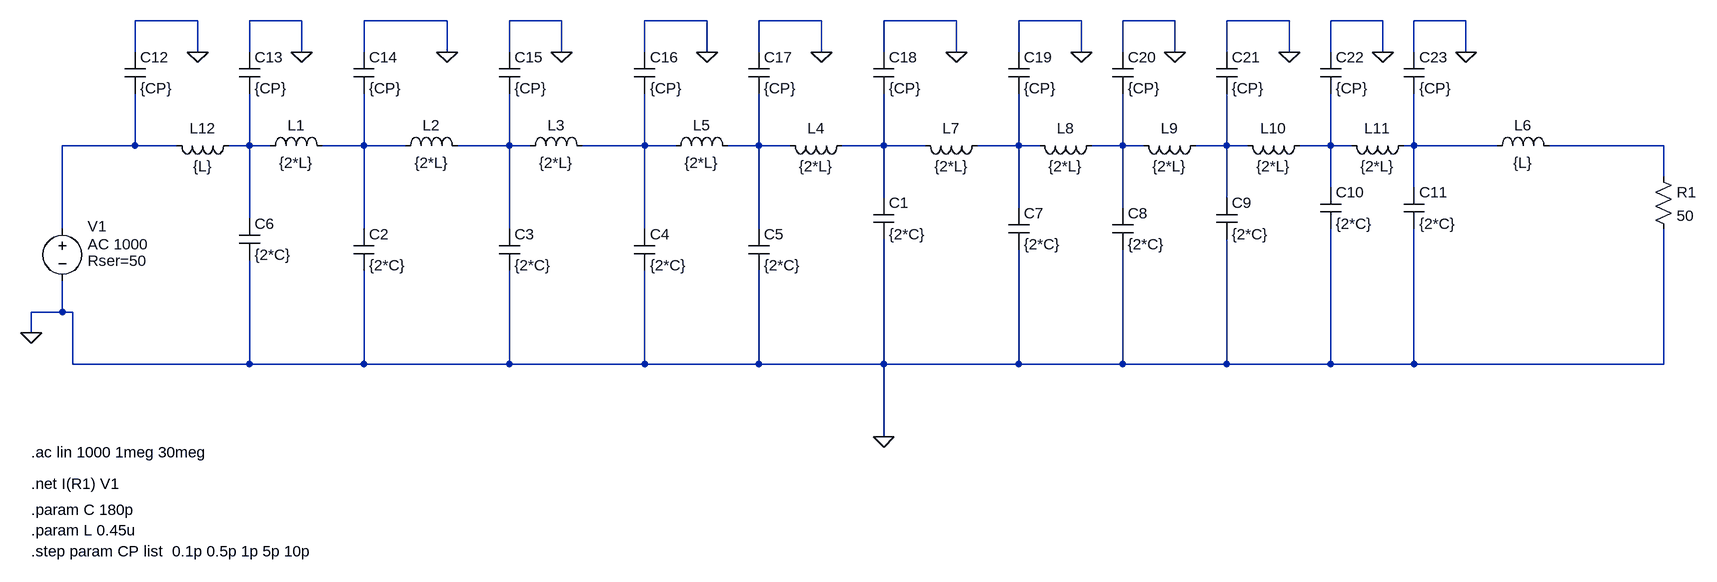
[diagram p0: schematic basicLC_fixcp.asc]
basicLC_fixcp.asc, the LTspice schematic file:
Version 4
SHEET 1 1324 680
WIRE -1408 -368 -1504 -368
WIRE -1248 -368 -1328 -368
WIRE -1024 -368 -1152 -368
WIRE -848 -368 -928 -368
WIRE -624 -368 -720 -368
WIRE -448 -368 -544 -368
WIRE -240 -368 -352 -368
WIRE -48 -368 -144 -368
WIRE 96 -368 16 -368
WIRE 272 -368 176 -368
WIRE 416 -368 336 -368
WIRE 544 -368 464 -368
WIRE -1504 -320 -1504 -368
WIRE -1408 -320 -1408 -368
WIRE -1328 -320 -1328 -368
WIRE -1248 -320 -1248 -368
WIRE -1152 -320 -1152 -368
WIRE -1024 -320 -1024 -368
WIRE -928 -320 -928 -368
WIRE -848 -320 -848 -368
WIRE -720 -320 -720 -368
WIRE -624 -320 -624 -368
WIRE -544 -320 -544 -368
WIRE -448 -320 -448 -368
WIRE -352 -320 -352 -368
WIRE -240 -320 -240 -368
WIRE -144 -320 -144 -368
WIRE -48 -320 -48 -368
WIRE 16 -320 16 -368
WIRE 96 -320 96 -368
WIRE 176 -320 176 -368
WIRE 272 -320 272 -368
WIRE 336 -320 336 -368
WIRE 416 -320 416 -368
WIRE 464 -320 464 -368
WIRE 544 -320 544 -368
WIRE -1504 -176 -1504 -256
WIRE -1504 -176 -1616 -176
WIRE -1440 -176 -1504 -176
WIRE -1328 -176 -1328 -256
WIRE -1328 -176 -1360 -176
WIRE -1296 -176 -1328 -176
WIRE -1152 -176 -1152 -256
WIRE -1152 -176 -1216 -176
WIRE -1088 -176 -1152 -176
WIRE -928 -176 -928 -256
WIRE -928 -176 -1008 -176
WIRE -896 -176 -928 -176
WIRE -720 -176 -720 -256
WIRE -720 -176 -816 -176
WIRE -672 -176 -720 -176
WIRE -544 -176 -544 -256
WIRE -544 -176 -592 -176
WIRE -496 -176 -544 -176
WIRE -352 -176 -352 -256
WIRE -352 -176 -416 -176
WIRE -288 -176 -352 -176
WIRE -144 -176 -144 -256
WIRE -144 -176 -208 -176
WIRE -112 -176 -144 -176
WIRE 16 -176 16 -256
WIRE 16 -176 -32 -176
WIRE 48 -176 16 -176
WIRE 176 -176 176 -256
WIRE 176 -176 128 -176
WIRE 208 -176 176 -176
WIRE 336 -176 336 -256
WIRE 336 -176 288 -176
WIRE 368 -176 336 -176
WIRE 464 -176 464 -256
WIRE 464 -176 448 -176
WIRE 592 -176 464 -176
WIRE 848 -176 672 -176
WIRE 848 -128 848 -176
WIRE 336 -112 336 -176
WIRE 464 -112 464 -176
WIRE -352 -96 -352 -176
WIRE 176 -96 176 -176
WIRE -144 -80 -144 -176
WIRE 16 -80 16 -176
WIRE -1328 -64 -1328 -176
WIRE -1616 -48 -1616 -176
WIRE -1152 -48 -1152 -176
WIRE -928 -48 -928 -176
WIRE -720 -48 -720 -176
WIRE -544 -48 -544 -176
WIRE -1616 80 -1616 32
WIRE -1616 80 -1664 80
WIRE -1600 80 -1616 80
WIRE -1664 112 -1664 80
WIRE -1600 160 -1600 80
WIRE -1328 160 -1328 0
WIRE -1328 160 -1600 160
WIRE -1152 160 -1152 16
WIRE -1152 160 -1328 160
WIRE -928 160 -928 16
WIRE -928 160 -1152 160
WIRE -720 160 -720 16
WIRE -720 160 -928 160
WIRE -544 160 -544 16
WIRE -544 160 -720 160
WIRE -352 160 -352 -32
WIRE -352 160 -544 160
WIRE -144 160 -144 -16
WIRE -144 160 -352 160
WIRE 16 160 16 -16
WIRE 16 160 -144 160
WIRE 176 160 176 -32
WIRE 176 160 16 160
WIRE 336 160 336 -48
WIRE 336 160 176 160
WIRE 464 160 464 -48
WIRE 464 160 336 160
WIRE 848 160 848 -48
WIRE 848 160 464 160
WIRE -352 272 -352 160
FLAG -1664 112 0
FLAG -352 272 0
FLAG -1408 -320 0
FLAG -1248 -320 0
FLAG -1024 -320 0
FLAG -848 -320 0
FLAG -624 -320 0
FLAG -448 -320 0
FLAG -240 -320 0
FLAG -48 -320 0
FLAG 96 -320 0
FLAG 272 -320 0
FLAG 416 -320 0
FLAG 544 -320 0
SYMBOL voltage -1616 -64 R0
WINDOW 0 39 12 Left 2
WINDOW 123 39 40 Left 2
WINDOW 39 39 65 Left 2
SYMATTR InstName V1
SYMATTR Value2 AC 1000
SYMATTR SpiceLine Rser=50
SYMATTR Value ""
SYMBOL ind -1312 -160 R270
WINDOW 0 32 56 VTop 2
WINDOW 3 5 56 VBottom 2
SYMATTR InstName L1
SYMATTR Value {2*L}
SYMBOL ind -1104 -160 R270
WINDOW 0 32 56 VTop 2
WINDOW 3 5 56 VBottom 2
SYMATTR InstName L2
SYMATTR Value {2*L}
SYMBOL ind -912 -160 R270
WINDOW 0 32 56 VTop 2
WINDOW 3 5 56 VBottom 2
SYMATTR InstName L3
SYMATTR Value {2*L}
SYMBOL ind -688 -160 R270
WINDOW 0 32 56 VTop 2
WINDOW 3 5 56 VBottom 2
SYMATTR InstName L5
SYMATTR Value {2*L}
SYMBOL ind 576 -160 R270
WINDOW 0 32 56 VTop 2
WINDOW 3 5 56 VBottom 2
SYMATTR InstName L6
SYMATTR Value {L}
SYMBOL res 832 -144 R0
SYMATTR InstName R1
SYMATTR Value 50
SYMBOL cap -1168 -48 R0
SYMATTR InstName C2
SYMATTR Value {2*C}
SYMBOL cap -944 -48 R0
SYMATTR InstName C3
SYMATTR Value {2*C}
SYMBOL cap -736 -48 R0
SYMATTR InstName C4
SYMATTR Value {2*C}
SYMBOL cap -560 -48 R0
SYMATTR InstName C5
SYMATTR Value {2*C}
SYMBOL cap -368 -96 R0
SYMATTR InstName C1
SYMATTR Value {2*C}
SYMBOL ind -400 -192 R90
WINDOW 0 5 56 VBottom 2
WINDOW 3 32 56 VTop 2
SYMATTR InstName L4
SYMATTR Value {2*L}
SYMBOL ind -192 -192 R90
WINDOW 0 5 56 VBottom 2
WINDOW 3 32 56 VTop 2
SYMATTR InstName L7
SYMATTR Value {2*L}
SYMBOL ind -16 -192 R90
WINDOW 0 5 56 VBottom 2
WINDOW 3 32 56 VTop 2
SYMATTR InstName L8
SYMATTR Value {2*L}
SYMBOL ind 144 -192 R90
WINDOW 0 5 56 VBottom 2
WINDOW 3 32 56 VTop 2
SYMATTR InstName L9
SYMATTR Value {2*L}
SYMBOL ind 304 -192 R90
WINDOW 0 5 56 VBottom 2
WINDOW 3 32 56 VTop 2
SYMATTR InstName L10
SYMATTR Value {2*L}
SYMBOL ind 464 -192 R90
WINDOW 0 5 56 VBottom 2
WINDOW 3 32 56 VTop 2
SYMATTR InstName L11
SYMATTR Value {2*L}
SYMBOL ind -1344 -192 R90
WINDOW 0 5 56 VBottom 2
WINDOW 3 32 56 VTop 2
SYMATTR InstName L12
SYMATTR Value {L}
SYMBOL cap -1344 -64 R0
SYMATTR InstName C6
SYMATTR Value {2*C}
SYMBOL cap -160 -80 R0
SYMATTR InstName C7
SYMATTR Value {2*C}
SYMBOL cap 0 -80 R0
SYMATTR InstName C8
SYMATTR Value {2*C}
SYMBOL cap 160 -96 R0
SYMATTR InstName C9
SYMATTR Value {2*C}
SYMBOL cap 320 -112 R0
SYMATTR InstName C10
SYMATTR Value {2*C}
SYMBOL cap 448 -112 R0
SYMATTR InstName C11
SYMATTR Value {2*C}
SYMBOL cap -1520 -320 R0
SYMATTR InstName C12
SYMATTR Value {CP}
SYMBOL cap -1344 -320 R0
SYMATTR InstName C13
SYMATTR Value {CP}
SYMBOL cap -1168 -320 R0
SYMATTR InstName C14
SYMATTR Value {CP}
SYMBOL cap -944 -320 R0
SYMATTR InstName C15
SYMATTR Value {CP}
SYMBOL cap -736 -320 R0
SYMATTR InstName C16
SYMATTR Value {CP}
SYMBOL cap -560 -320 R0
SYMATTR InstName C17
SYMATTR Value {CP}
SYMBOL cap -368 -320 R0
SYMATTR InstName C18
SYMATTR Value {CP}
SYMBOL cap -160 -320 R0
SYMATTR InstName C19
SYMATTR Value {CP}
SYMBOL cap 0 -320 R0
SYMATTR InstName C20
SYMATTR Value {CP}
SYMBOL cap 160 -320 R0
SYMATTR InstName C21
SYMATTR Value {CP}
SYMBOL cap 320 -320 R0
SYMATTR InstName C22
SYMATTR Value {CP}
SYMBOL cap 448 -320 R0
SYMATTR InstName C23
SYMATTR Value {CP}
TEXT -1664 296 Left 2 !.ac lin 1000 1meg 30meg
TEXT -1664 344 Left 2 !.net I(R1) V1
TEXT -1664 384 Left 2 !.param C 180p
TEXT -1664 416 Left 2 !.param L 0.45u
TEXT -1664 448 Left 2 !.step param CP list  0.1p 0.5p 1p 5p 10p

The netlist it stands for:
* basicLC_fixcp.asc
V1 N001 0 AC 1000 Rser=50
L1 N002 N003 {2*L}
L2 N003 N004 {2*L}
L3 N004 N005 {2*L}
L5 N005 N006 {2*L}
L6 N012 N013 {L}
R1 N013 0 50
C2 N003 0 {2*C}
C3 N004 0 {2*C}
C4 N005 0 {2*C}
C5 N006 0 {2*C}
C1 N007 0 {2*C}
L4 N007 N006 {2*L}
L7 N008 N007 {2*L}
L8 N009 N008 {2*L}
L9 N010 N009 {2*L}
L10 N011 N010 {2*L}
L11 N012 N011 {2*L}
L12 N002 N001 {L}
C6 N002 0 {2*C}
C7 N008 0 {2*C}
C8 N009 0 {2*C}
C9 N010 0 {2*C}
C10 N011 0 {2*C}
C11 N012 0 {2*C}
C12 0 N001 {CP}
C13 0 N002 {CP}
C14 0 N003 {CP}
C15 0 N004 {CP}
C16 0 N005 {CP}
C17 0 N006 {CP}
C18 0 N007 {CP}
C19 0 N008 {CP}
C20 0 N009 {CP}
C21 0 N010 {CP}
C22 0 N011 {CP}
C23 0 N012 {CP}
.ac lin 1000 1meg 30meg
.net I(R1) V1
.param C 180p
.param L 0.45u
.step param CP list  0.1p 0.5p 1p 5p 10p
.backanno
.end